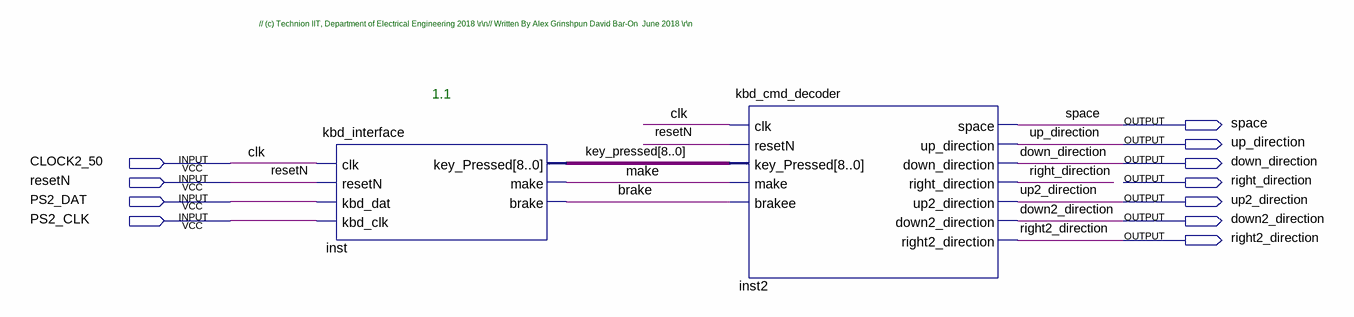
[diagram p0: schematic sheet]
// Quartus schematic TOP_KBD_DEMO.bdf as structural Verilog: 2 symbols, 11 pins
module TOP_KBD_DEMO (
  input  CLOCK2_50,
  input  resetN,
  input  PS2_DAT,
  input  PS2_CLK,
  output space,
  output up_direction,
  output down_direction,
  output right_direction,
  output up2_direction,
  output down2_direction,
  output right2_direction
);

  wire brake, make;
  wire [8:0] key_pressed;

  kbd_interface inst (
    .clk(CLOCK2_50), .resetN(resetN), .kbd_dat(PS2_DAT), .kbd_clk(PS2_CLK), .key_Pressed(key_pressed),
    .make(make), .brake(brake));
  kbd_cmd_decoder inst2 (
    .clk(CLOCK2_50), .resetN(resetN), .key_Pressed(key_pressed), .make(make), .brakee(brake), .space(space),
    .up_direction(up_direction), .down_direction(down_direction), .right_direction(right_direction),
    .up2_direction(up2_direction), .down2_direction(down2_direction), .right2_direction(right2_direction));

  // Other names for the same wires on the sheet: clk = CLOCK2_50

  // Notes on the sheet:
  //   // (c) Technion IIT, Department of Electrical Engineering 2018 \r\n// Written By Alex Grinshpun David Bar-On  June 2018 \r\n
  //   1.1
endmodule
